# Altium project Holberton.PrjPcb (part 3 of 4)

## Sheet Feedback.SchDoc
size 420 x 297 mm; DocumentNumber: 5; SheetNumber: 13; SheetTotal: 14; PageSetup: Record=PageOptions|CenterHorizontal=True|CenterVertical=True|PrintScale=0.96|XCorrection=1.00|YCorrection=1.00|PrintKind=1|BorderSize=5000000|LeftOffset=0|BottomOffset=0|Orientation=2|PaperLength=4318|PaperWidth=2794|Scale=100|PaperSource=7|PrintQuality=600|MediaType=1|DitherType=10|PaperKind=11" x 17"|PrintScaleMode=1
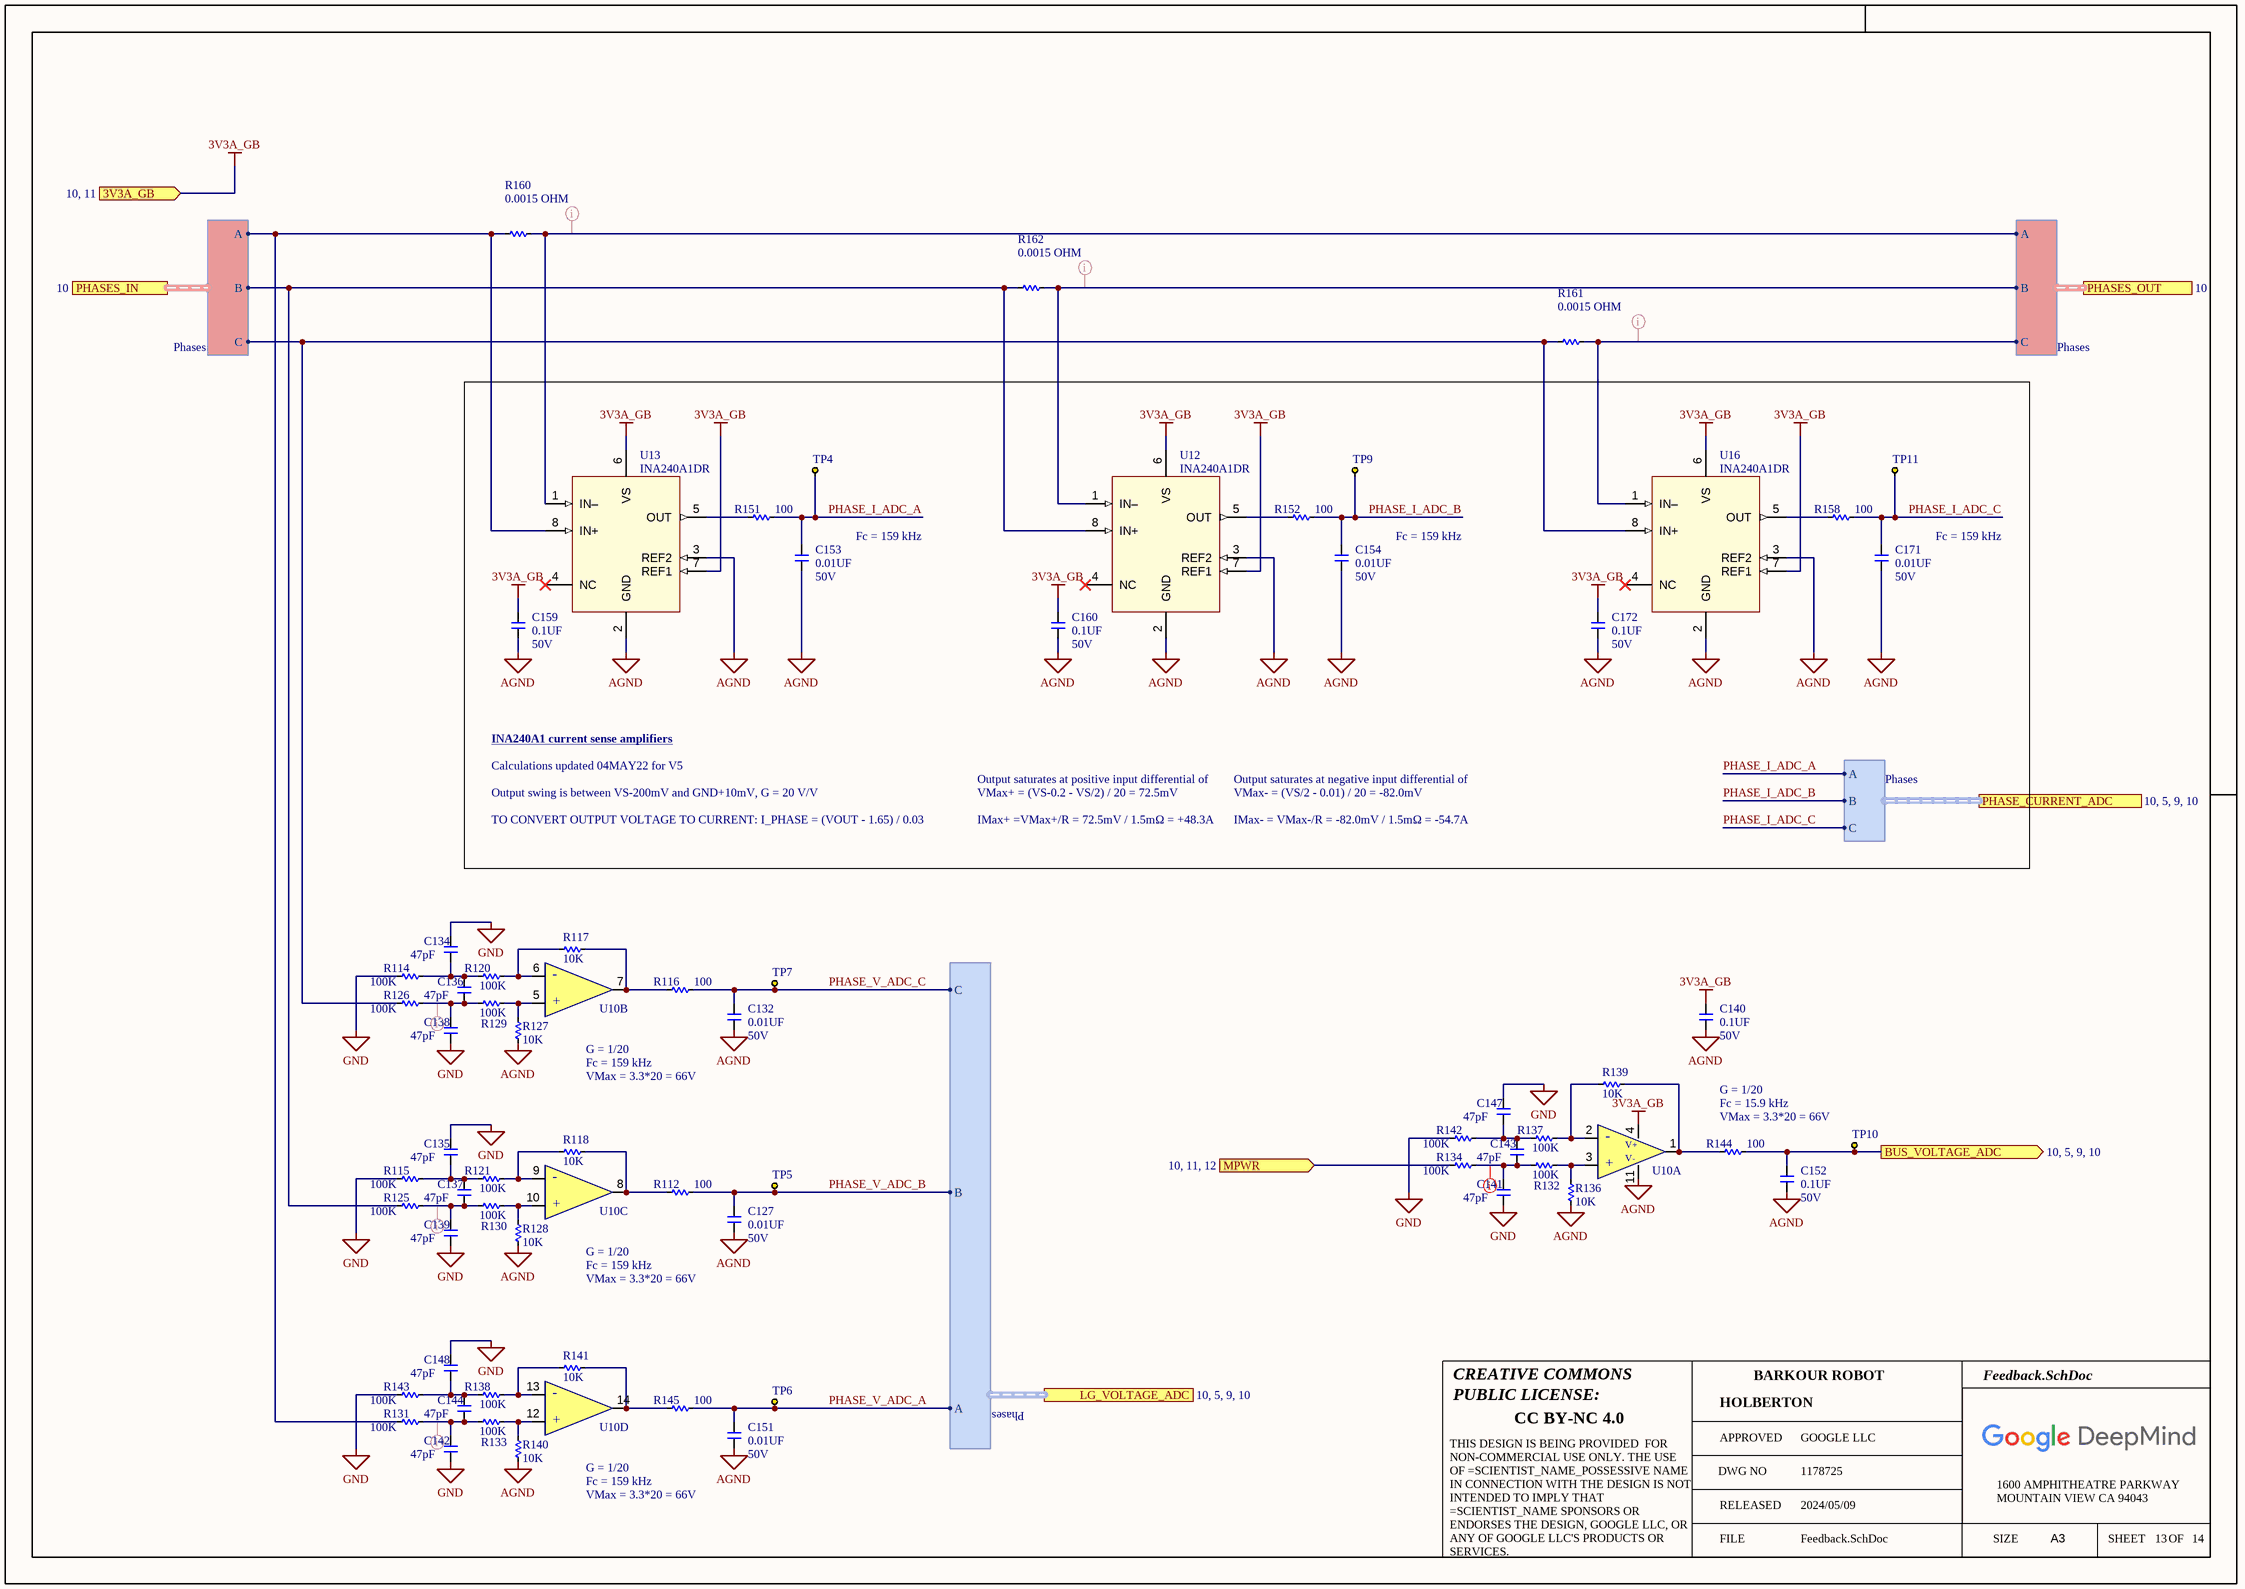
[diagram p9: Feedback.SchDoc]

### Parts
C127  value 0.01UF  Voltage: 50V  [C0402]  (hidden comment: __Template_Cap)
C132  value 0.01UF  Voltage: 50V  [C0402]  (hidden comment: __Template_Cap)
C134  value 47pF  [C0402]  (hidden comment: __Template_Cap)
C135  value 47pF  [C0402]  (hidden comment: __Template_Cap)
C136  value 47pF  [C0402]  (hidden comment: __Template_Cap)
C137  value 47pF  [C0402]  (hidden comment: __Template_Cap)
C138  value 47pF  [C0402]  (hidden comment: __Template_Cap)
C139  value 47pF  [C0402]  (hidden comment: __Template_Cap)
C140  value 0.1UF  Voltage: 50V  [C0402]  (hidden comment: __Template_Cap)
C141  value 47pF  [C0402]  (hidden comment: __Template_Cap)
C142  value 47pF  [C0402]  (hidden comment: __Template_Cap)
C143  value 47pF  [C0402]  (hidden comment: __Template_Cap)
C144  value 47pF  [C0402]  (hidden comment: __Template_Cap)
C147  value 47pF  [C0402]  (hidden comment: __Template_Cap)
C148  value 47pF  [C0402]  (hidden comment: __Template_Cap)
C151  value 0.01UF  Voltage: 50V  [C0402]  (hidden comment: __Template_Cap)
C152  value 0.1UF  Voltage: 50V  [C0402]  (hidden comment: __Template_Cap)
C153  value 0.01UF  Voltage: 50V  [C0402]  (hidden comment: __Template_Cap)
C154  value 0.01UF  Voltage: 50V  [C0402]  (hidden comment: __Template_Cap)
C159  value 0.1UF  Voltage: 50V  [C0402]  (hidden comment: __Template_Cap)
C160  value 0.1UF  Voltage: 50V  [C0402]  (hidden comment: __Template_Cap)
C171  value 0.01UF  Voltage: 50V  [C0402]  (hidden comment: __Template_Cap)
C172  value 0.1UF  Voltage: 50V  [C0402]  (hidden comment: __Template_Cap)
R112  100  [R0402]
R114  100K  [R0603]
R115  100K  [R0603]
R116  100  [R0402]
R117  10K  [R0402]
R118  10K  [R0402]
R120  100K  [R0603]
R121  100K  [R0603]
R125  100K  [R0603]
R126  100K  [R0603]
R127  10K  [R0402]
R128  10K  [R0402]
R129  100K  [R0603]
R130  100K  [R0603]
R131  100K  [R0603]
R132  100K  [R0603]
R133  100K  [R0603]
R134  100K  [R0603]
R136  10K  [R0402]
R137  100K  [R0603]
R138  100K  [R0603]
R139  10K  [R0402]
R140  10K  [R0402]
R141  10K  [R0402]
R142  100K  [R0603]
R143  100K  [R0603]
R144  100  [R0402]
R145  100  [R0402]
R151  100  [R0402]
R152  100  [R0402]
R158  100  [R0402]
R160  0.0015 OHM  [R2512]
R161  0.0015 OHM  [R2512]
R162  0.0015 OHM  [R2512]
TP4  TEST_KEYSTONE5015  [TP_KEYSTONE_5015]  (value not drawn)
TP5  TEST_KEYSTONE5015  [TP_KEYSTONE_5015]  (value not drawn)
TP6  TEST_KEYSTONE5015  [TP_KEYSTONE_5015]  (value not drawn)
TP7  TEST_KEYSTONE5015  [TP_KEYSTONE_5015]  (value not drawn)
TP9  TEST_KEYSTONE5015  [TP_KEYSTONE_5015]  (value not drawn)
TP10  TEST_KEYSTONE5015  [TP_KEYSTONE_5015]  (value not drawn)
TP11  TEST_KEYSTONE5015  [TP_KEYSTONE_5015]  (value not drawn)
U10  MCP6064  [14TSSOP65]  (value not drawn)  (parts A,B,C,D of 4)
U12  INA240A1DR  [TI SOIC-8 D0008A]
U13  INA240A1DR  [TI SOIC-8 D0008A]
U16  INA240A1DR  [TI SOIC-8 D0008A]

### Ports
3V3A_GB (in, see 10, 11), BUS_VOLTAGE_ADC (out, see 10, 5, 9, 10), LG_VOLTAGE_ADC (harness Phases, see 10, 5, 9, 10), MPWR (in, see 10, 11, 12), PHASE_CURRENT_ADC (harness Phases, see 10, 5, 9, 10), PHASES_IN (harness Phases, see 10), PHASES_OUT (harness Phases, see 10)

### Harnesses
Phases: A, B, C

### Nets
3V3A_GB: C140.1 C159.1 C160.1 C172.1 U10.4 U12.6(VS) U12.7(REF1) U13.6(VS) U13.7(REF1) U16.6(VS) U16.7(REF1) ; port 3V3A_GB
AGND: C127.2 C132.2 C140.2 C151.2 C152.2 C153.2 C154.2 C159.2 C160.2 C171.2 C172.2 R127.1 R128.1 R136.1 R140.1 U10.11 U12.2(GND) U12.3(REF2) U13.2(GND) U13.3(REF2) U16.2(GND) U16.3(REF2)
GND: C134.2 C135.2 C138.1 C139.1 C141.1 C142.1 C147.2 C148.2 R114.1 R115.1 R142.1 R143.1
MPWR: R134.1 ; port MPWR
BUS_VOLTAGE_ADC: C152.1 R144.2 TP10.1 ; port BUS_VOLTAGE_ADC
PHASE_I_ADC_A: C153.1 R151.2 TP4.1 ; port PHASE_CURRENT_ADC.A  [project net IA_ADC]
PHASE_I_ADC_B: C154.1 R152.2 TP9.1 ; port PHASE_CURRENT_ADC.B  [project net IB_ADC]
PHASE_I_ADC_C: C171.1 R158.2 TP11.1 ; port PHASE_CURRENT_ADC.C  [project net IC_ADC]
PHASE_V_ADC_A: C151.1 R145.2 TP6.1 ; port LG_VOLTAGE_ADC.A
PHASE_V_ADC_B: C127.1 R112.2 TP5.1 ; port LG_VOLTAGE_ADC.B
PHASE_V_ADC_C: C132.1 R116.2 TP7.1 ; port LG_VOLTAGE_ADC.C
PHASEA: R131.1 R160.1 U13.8(IN+) ; port PHASES_IN.A
PHASEA_OUT: R160.2 U13.1(IN–) ; port PHASES_OUT.A
PHASEB: R125.1 R162.1 U12.8(IN+) ; port PHASES_IN.B
PHASEB_OUT: R162.2 U12.1(IN–) ; port PHASES_OUT.B
PHASEC: R126.1 R161.1 U16.8(IN+) ; port PHASES_IN.C
PHASEC_OUT: R161.2 U16.1(IN–) ; port PHASES_OUT.C
NetC134_1: C134.1 C136.2 R114.2 R120.1
NetC135_1: C135.1 C137.2 R115.2 R121.1
NetC136_1: C136.1 C138.2 R126.2 R129.1
NetC137_1: C137.1 C139.2 R125.2 R130.1
NetC141_2: C141.2 C143.1 R132.1 R134.2
NetC142_2: C142.2 C144.1 R131.2 R133.1
NetC143_2: C143.2 C147.1 R137.1 R142.2
NetC144_2: C144.2 C148.1 R138.1 R143.2
NetR112_1: R112.1 R118.1 U10.8
NetR116_1: R116.1 R117.1 U10.7
NetR117_2: R117.2 R120.2 U10.6
NetR118_2: R118.2 R121.2 U10.9
NetR127_2: R127.2 R129.2 U10.5
NetR128_2: R128.2 R130.2 U10.10
NetR132_2: R132.2 R136.2 U10.3
NetR133_2: R133.2 R140.2 U10.12
NetR137_2: R137.2 R139.2 U10.2
NetR138_2: R138.2 R141.2 U10.13
NetR139_1: R139.1 R144.1 U10.1
NetR141_1: R141.1 R145.1 U10.14
NetR151_1: R151.1 U13.5(OUT)
NetR152_1: R152.1 U12.5(OUT)
NetR158_1: R158.1 U16.5(OUT)

Not connected (* = marked no-connect by the designer): U12 4(NC)*; U13 4(NC)*; U16 4(NC)*

### Layout directives
net class HVSW: NetC136_1, NetC137_1, NetC142_2, PHASEA_OUT, PHASEB_OUT, PHASEC_OUT
net class HV: NetC141_2

### Notes on the sheet
- Fc = 159 kHz
- Output swing is between VS-200mV and GND+10mV, G = 20 V/V
- INA240A1 current sense amplifiers <https://www.ti.com/lit/ds/symlink/ina240.pdf>
- Calculations updated 04MAY22 for V5
- VMax+ = (VS-0.2 - VS/2) / 20 = 72.5mV
- Output saturates at positive input differential of
- VMax- = (VS/2 - 0.01) / 20 = -82.0mV
- Output saturates at negative input differential of
- TO CONVERT OUTPUT VOLTAGE TO CURRENT: I_PHASE = (VOUT - 1.65) / 0.03
- IMax+ =VMax+/R = 72.5mV / 1.5mΩ = +48.3A
- IMax- = VMax-/R = -82.0mV / 1.5mΩ = -54.7A
- (near U10) G = 1/20
- VMax = 3.3*20 = 66V
- Fc = 15.9 kHz
- G = 1/20
- CREATIVE COMMONS
- PUBLIC LICENSE:
- BARKOUR ROBOT
- CC BY-NC 4.0
- APPROVED
- DWG NO
- GOOGLE LLC
- FILE
- RELEASED
- 2024/05/09
- SIZE
- 1600 AMPHITHEATRE PARKWAY
- MOUNTAIN VIEW CA 94043
- A3
- SHEET
- OF
- THIS DESIGN IS BEING PROVIDED  FOR NON-COMMERCIAL USE ONLY. THE USE OF =SCIENTIST_NAME_POSSESSIVE NAME IN CONNECTION WITH THE DESIGN IS NOT INTENDED TO IMPLY THAT =SCIENTIST_NAME SPONSORS OR ENDORSES THE DESIGN, GOOGLE LLC, OR ANY OF GOOGLE LLC'S PRODUCTS OR SERVICES.
- (in symbol MICROCHIP_MCP6064, part A) -; V+; V-; +
- (in symbol MICROCHIP_MCP6064, part B) -; +
- (in symbol MICROCHIP_MCP6064, part C) -; +
- (in symbol MICROCHIP_MCP6064, part D) -; +

### Library data of the parts
C127 C132 C151 C153 C154 C171 = 625: CAP, CER, X7R, 0.01uF, 50V, 20%, 0402, 0.56mm T; MFG: KEMET; MFG P/N: C0402C103M5RACTU; COMMON: 150-00227-00; Status: Released; Package: 0402; Supplier 1: Digi-Key; ComponentLink1URL: https://www.digikey.com/en/products/detail/kemet/C0402C103M5RAC7867/2196227; Supplier Part Number 1: 399-C0402C103M5RAC7867CT-ND
C134-C139 C141-C144 C147 C148 = 1447: CAP, CER, C0G, 47PF, 5%, 50V, 0402; MFG: TDK; MFG P/N: C1005C0G1H470J050BA; COMMON: 150-00181-00; Status: NRND; Package: 0402; Voltage: 50V; Supplier 1: Digi-Key; ComponentLink1URL: https://www.digikey.com/en/products/detail/tdk-corporation/C1005C0G1H470J050BA/513693; Supplier Part Number 1: 445-1243-1-ND
C140 C152 C159 C160 C172 = 1762: CAP, CER, X5R, 0.1uF, 10%, 50V, 0402, 0.55mm; MFG: YAGEO; MFG P/N: CC0402KRX5R9BB104; Status: Released; Package: 0402; Supplier 1: Digi-Key; ComponentLink1URL: http://www.yageo.com/documents/recent/UPY-GPHC_X5R_4V-to-50V_25.pdf; Supplier Part Number 1: 311-3342-1-ND
R112 R116 R144 R145 R151 R152 R158 = 7286: RES, 100, 1%, 1/10W, 0402, AUTO GRADE; MFG: PANASONIC; MFG P/N: ERJ2RKF1000X; COMMON: 470-00294-00; Status: Released; Package: 0402; Value: 100; Supplier 1: Digi-Key; ComponentLink1URL: https://www.digikey.com/en/products/detail/panasonic-electronic-components/ERJ-2RKF1000X/192080; Supplier Part Number 1: P100LCT-ND
R114 R115 R120 R121 R125 R126 R129-R134 R137 R138 R142 R143 = 6516: RES, 100K, 1%, 1/10W, 0603, AUTO GRADE; MFG: PANASONIC; MFG P/N: ERJ3EKF1003V; COMMON: 470-00120-00; Status: Released; Package: 0603; Value: 100K; Supplier 1: Digi-Key; ComponentLink1URL: https://www.digikey.com/en/products/detail/panasonic-electronic-components/ERJ-3EKF1003V/196075; Supplier Part Number 1: P100KHCT-ND
R117 R118 R127 R128 R136 R139-R141 = 7216: RES, 10K, 1%, 1/10W, 0402, AUTOGRADE; MFG: PANASONIC; MFG P/N: ERJ2RKF1002X; COMMON: 470-00319-00; Status: Released; Package: 0402; Value: 10K; Supplier 1: Digi-Key; ComponentLink1URL: https://www.digikey.com/en/products/detail/panasonic-electronic-components/ERJ-2RKF1002X/192073; Supplier Part Number 1: P10.0KLCT-ND
R160-R162 = 9999: RES, 0.0015, 1%, 3W, 2512; MFG: TE Connectivity Passive Product; MFG P/N: TLR3A30DR0015FTDG; Status: Released; Package: 2512; Value: 0.0015 OHM; Supplier 1: Digi-Key; ComponentLink1URL: https://www.te.com/commerce/DocumentDelivery/DDEController?Action=srchrtrv&DocNm=1773449-3&DocType=DS&DocLang=English; Supplier Part Number 1: A131795CT-ND
TP4-TP7 TP9-TP11 = TEST_KEYSTONE5015: PC TEST POINT MINIATURE SMT; MFG: Keystone Electronics; MFG P/N: 5015; Value: 5015; COMMON: 250-00207-00; Supplier 1: Digi-Key; ComponentLink1URL: http://mail.keyelco.com/ENG._DEPT/PDF%20CAT%20NO%20Drawings/5015.pdf; Supplier Part Number 1: 36-5015CT-ND; Status: In Development
U10 = MICROCHIP_MCP6064: Microchip MCP6064-E/ST; Quad Op Amp; 0.73MHz CMOS; Rail to Rail; 3V; 5V; 14-Pin TSSOP; MFG: Microchip Technology; ComponentLink1URL: http://www.microchip.com/mymicrochip/filehandler.aspx?ddocname=en528763; Supplier 1: Digi-Key; Supplier Part Number 1: MCP6064-E/ST-ND; MFG P/N: MCP6064-E/ST; Value: MCP6064-E/ST
U12 U13 U16 = INA240A1: Current Sense Amplifiers -4 to 80V, bidirectional, ultra-precise current sense amplifier with enhanced PWM rejection, 20V/V gain; MFG: Texas Instruments; Supplier 1: Digi-Key; Supplier Part Number 1: 296-51172-1-ND; ComponentLink1URL: https://www.digikey.com/en/products/detail/texas-instruments/INA240A1DR/8538109; MFG P/N: INA240A1DR; Value: INA240A1DR

## Sheet Drive.SchDoc
size 420 x 297 mm; DocumentNumber: 2; SheetNumber: 11; SheetTotal: 14; PageSetup: Record=PageOptions|CenterHorizontal=True|CenterVertical=True|PrintScale=0.96|XCorrection=1.00|YCorrection=1.00|PrintKind=1|BorderSize=5000000|LeftOffset=0|BottomOffset=0|Orientation=2|PaperLength=4318|PaperWidth=2794|Scale=100|PaperSource=7|PrintQuality=600|MediaType=1|DitherType=10|PaperKind=11" x 17"|PrintScaleMode=1
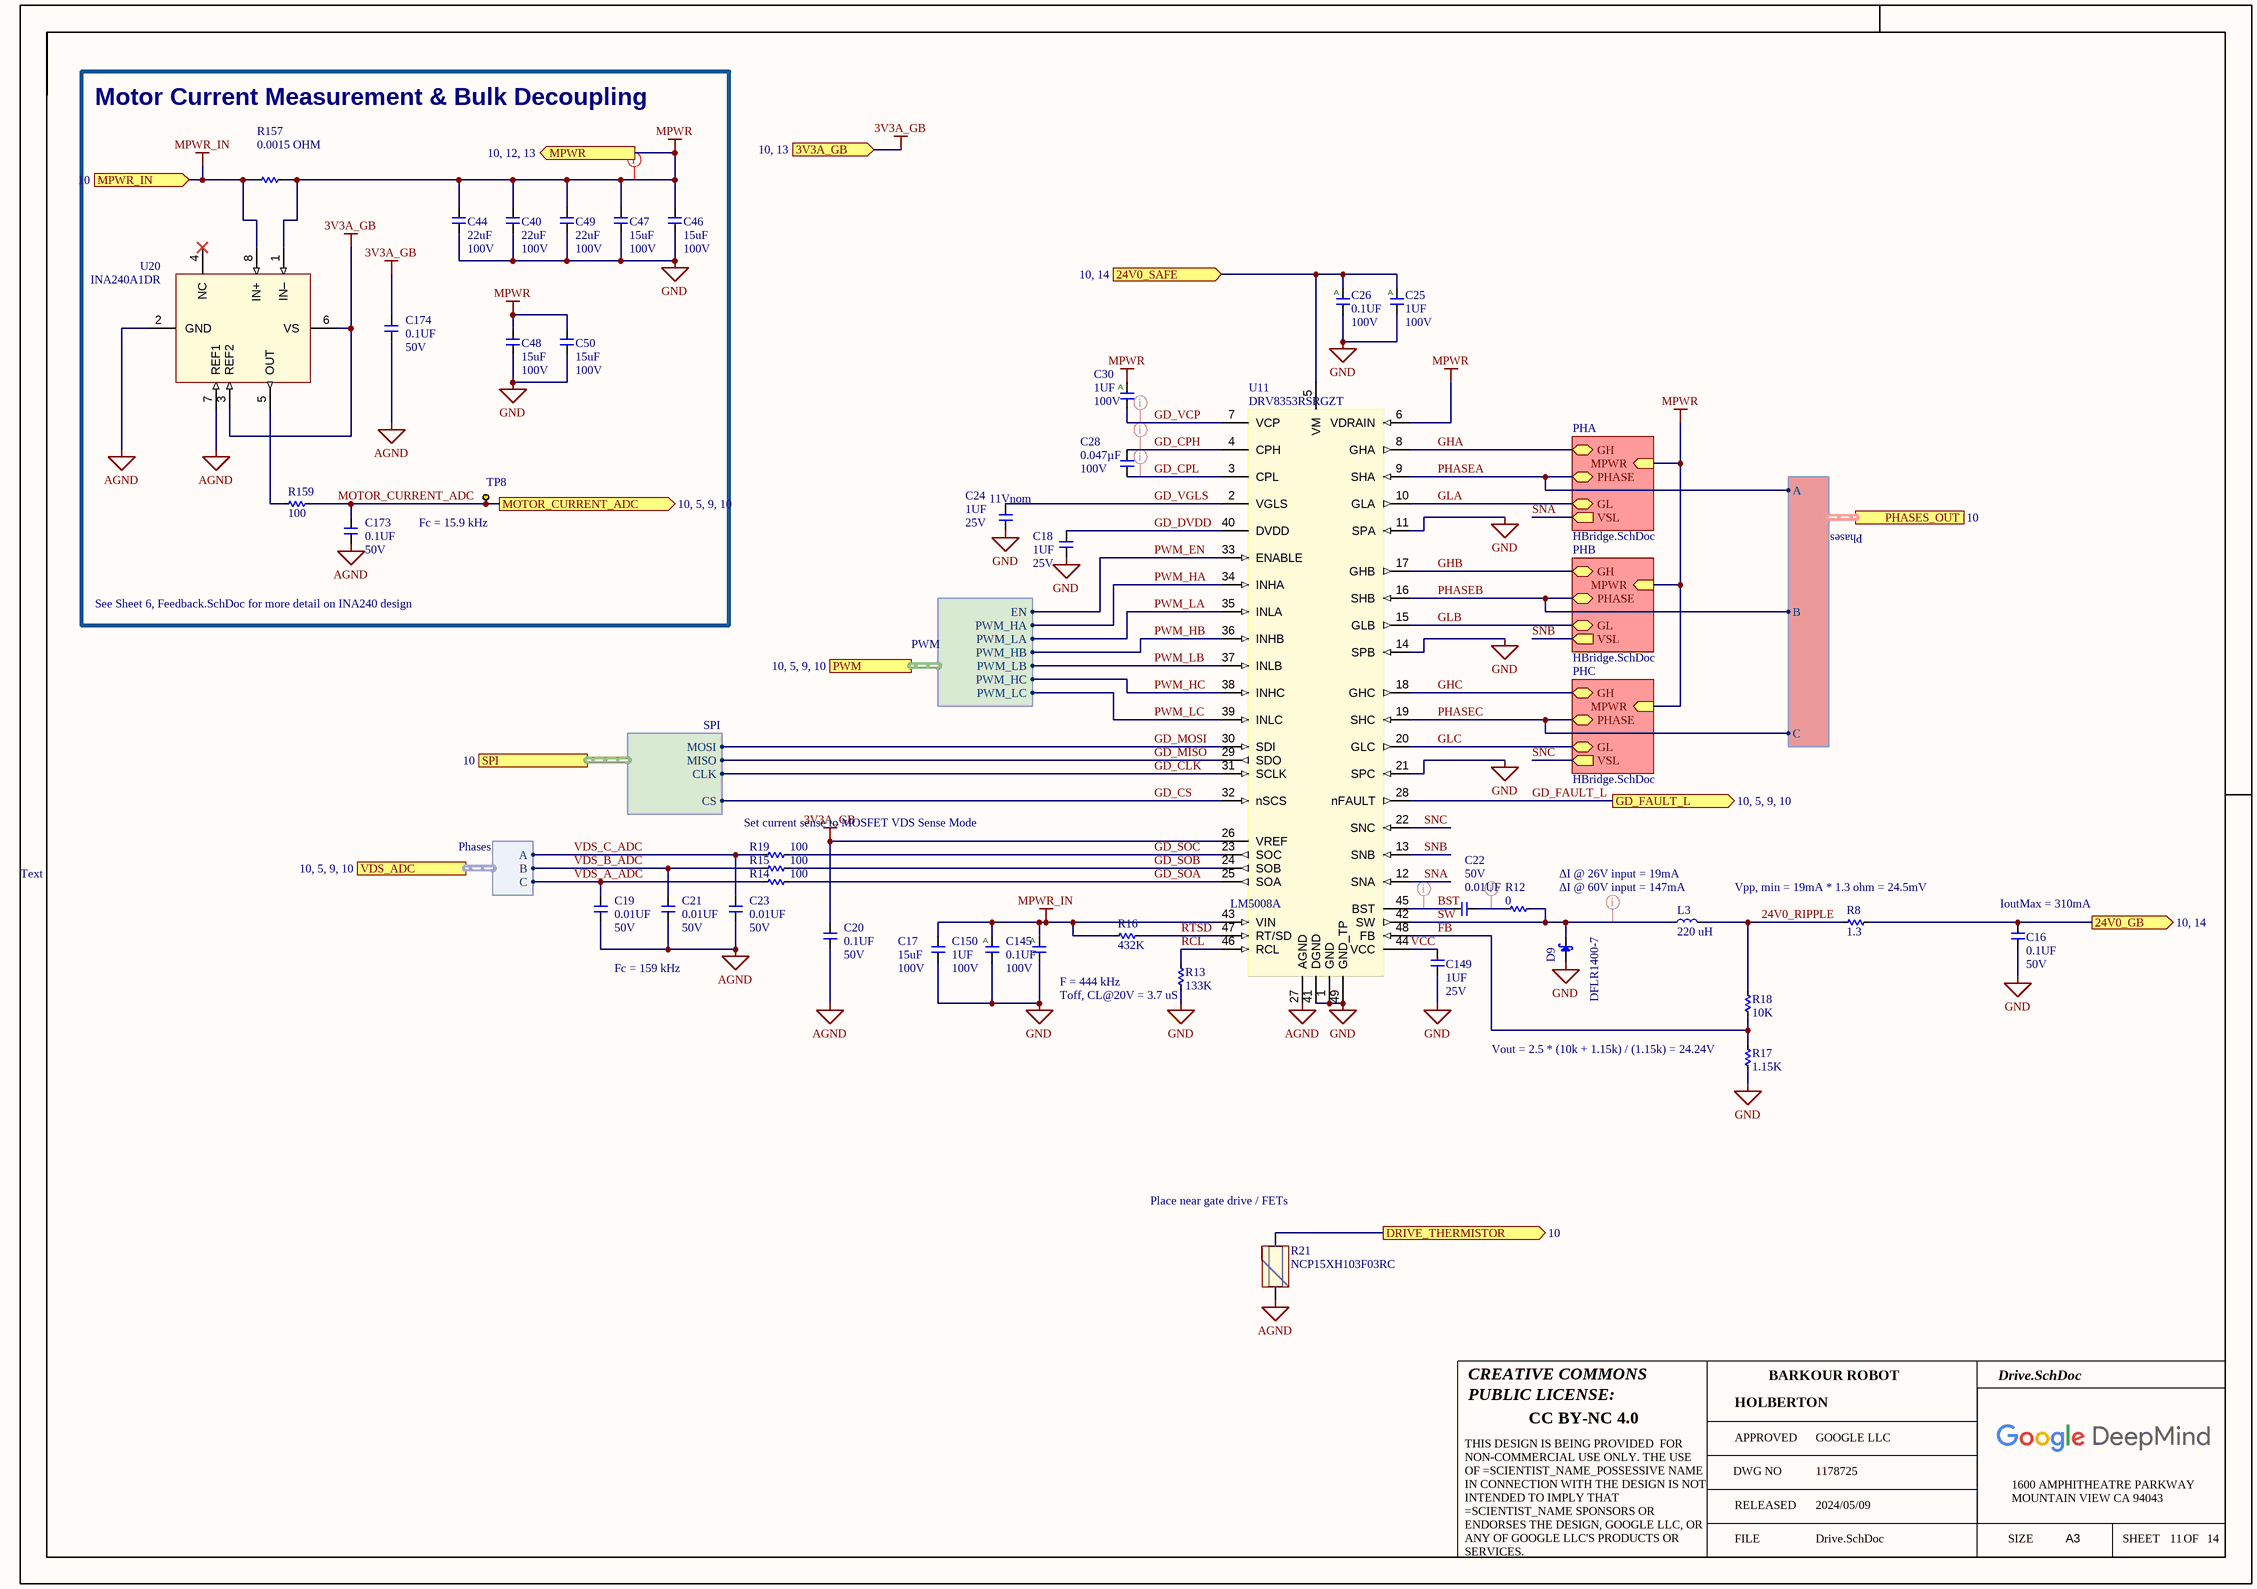
[diagram p10: Drive.SchDoc]

### Parts
C16  value 0.1UF  Voltage: 50V  [C0402]  (hidden comment: __Template_Cap)
C17  value 15uF  Voltage: 100V  [C2220]  (hidden comment: __Template_Cap)
C18  value 1UF  Voltage: 25V  [C0402]  (hidden comment: __Template_Cap)
C19  value 0.01UF  Voltage: 50V  [C0402]  (hidden comment: __Template_Cap)
C20  value 0.1UF  Voltage: 50V  [C0402]  (hidden comment: __Template_Cap)
C21  value 0.01UF  Voltage: 50V  [C0402]  (hidden comment: __Template_Cap)
C22  value 0.01UF  Voltage: 50V  [C0402]  (hidden comment: __Template_Cap)
C23  value 0.01UF  Voltage: 50V  [C0402]  (hidden comment: __Template_Cap)
C24  value 1UF  Voltage: 25V  [C0402]  (hidden comment: __Template_Cap)
C25  value 1UF  Voltage: 100V  [C0805]  (hidden comment: __Template_Cap_Auto)
C26  value 0.1UF  Voltage: 100V  [C0603]  (hidden comment: __Template_Cap_Auto)
C28  value 0.047µF  Voltage: 100V  [C0603]  (hidden comment: __Template_Cap)
C30  value 1UF  Voltage: 100V  [C0805]  (hidden comment: __Template_Cap_Auto)
C40  value 22uF  Voltage: 100V  [CAP_CKG57NX7S2A226M500JJ]  (hidden comment: __Template_Cap)
C44  value 22uF  Voltage: 100V  [CAP_CKG57NX7S2A226M500JJ]  (hidden comment: __Template_Cap)
C46  value 15uF  Voltage: 100V  [C2220]  (hidden comment: __Template_Cap)
C47  value 15uF  Voltage: 100V  [C2220]  (hidden comment: __Template_Cap)
C48  value 15uF  Voltage: 100V  [C2220]  (hidden comment: __Template_Cap)
C49  value 22uF  Voltage: 100V  [CAP_CKG57NX7S2A226M500JJ]  (hidden comment: __Template_Cap)
C50  value 15uF  Voltage: 100V  [C2220]  (hidden comment: __Template_Cap)
C145  value 0.1UF  Voltage: 100V  [C0603]  (hidden comment: __Template_Cap_Auto)
C149  value 1UF  Voltage: 25V  [C0402]  (hidden comment: __Template_Cap)
C150  value 1UF  Voltage: 100V  [C0805]  (hidden comment: __Template_Cap_Auto)
C173  value 0.1UF  Voltage: 50V  [C0402]  (hidden comment: __Template_Cap)
C174  value 0.1UF  Voltage: 50V  [C0402]  (hidden comment: __Template_Cap)
D9  value DFLR1400-7  [POWERDI123_DFLS1100-7]  (hidden comment: __Template_Diode_Schottky_A/K)
L3  value 220 uH  [IND_74404054221]  (hidden comment: __Template_Inductor)
R8  1.3  [R0805]
R12  0  [R0402]
R13  133K  [R0402]
R14  100  [R0402]
R15  100  [R0402]
R16  432K  [R0402]
R17  1.15K  [R0402]
R18  10K  [R0402]
R19  100  [R0402]
R21  Mfg P/N: NCP15XH103F03RC  [R0402]  (hidden comment: __Template_Thermistor)
R157  0.0015 OHM  [R2512]
R159  100  [R0402]
TP8  TEST_KEYSTONE5015  [TP_KEYSTONE_5015]  (value not drawn)
U11  MFG P/N: DRV8353RSRGZT  [VQFN50P700X700X100-48-TP_TP-CUST_NO_VIAS]  (hidden comment: MOTOR_DRIVE_DRV8353RSRGZT)
U20  INA240A1DR  [TI SOIC-8 D0008A]

### Blocks framed on the sheet
Motor Current Measurement & Bulk Decoupling: C40 C44 C46-C50 C173 C174 R157 R159 TP8 U20

### Sub-sheets
PHA = HBridge.SchDoc: GL (bidir), GH (bidir), PHASE (bidir), MPWR (in), VSL (out)
PHB = HBridge.SchDoc: GL (bidir), GH (bidir), PHASE (bidir), MPWR (in), VSL (out)
PHC = HBridge.SchDoc: GL (bidir), GH (bidir), PHASE (bidir), MPWR (in), VSL (out)

### Ports
3V3A_GB (in, see 10, 13), 24V0_GB (out, see 10, 14), 24V0_SAFE (in, see 10, 14), DRIVE_THERMISTOR (out, see 10), GD_FAULT_L (out, see 10, 5, 9, 10), MOTOR_CURRENT_ADC (out, see 10, 5, 9, 10), MPWR (out, see 10, 12, 13), MPWR_IN (in, see 10), PHASES_OUT (harness Phases, see 10), PWM (harness PWM, see 10, 5, 9, 10), SPI (harness SPI, see 10), VDS_ADC (harness Phases, see 10, 5, 9, 10)

### Harnesses
Phases: A, B, C
SPI: CLK, CS, MOSI, MISO
PWM: EN, PWM_HA, PWM_LA, PWM_HB, PWM_LB, PWM_HC, PWM_LC

### Nets
3V3A_GB: C20.1 C174.1 U11.26(VREF) U20.3(REF2) U20.6(VS) ; port 3V3A_GB
24V0_GB: C16.1 R8.2 ; port 24V0_GB
AGND: C19.2 C20.2 C21.2 C23.2 C173.2 C174.2 R21.2 U11.27(AGND) U20.2(GND) U20.7(REF1)
GND: C16.2 C17.2 C18.2 C24.2 C25.2 C26.2 C40.2 C44.2 C46.2 C47.2 C48.2 C49.2 C50.2 C145.2 C149.2 C150.2 D9.A R13.1 R17.1 U11.1(GND) U11.11(SPA) U11.14(SPB) U11.21(SPC) U11.41(DGND) U11.49(GND_TP)
MPWR: C30.1 C40.1 C44.1 C46.1 C47.1 C48.1 C49.1 C50.1 R157.2 U11.6(VDRAIN) U20.1(IN–) ; port MPWR, sheet PHA/MPWR, sheet PHB/MPWR, sheet PHC/MPWR
MPWR_IN: C17.1 C145.1 C150.1 R16.1 R157.1 U11.43(VIN) U20.8(IN+) ; port MPWR_IN
24V0_RIPPLE: L3.2 R8.1 R18.2
24V0_SAFE: C25.1 C26.1 U11.5(VM) ; port 24V0_SAFE
BST: C22.1 U11.45(BST)
DRIVE_THERM: R21.1 ; port DRIVE_THERMISTOR
FB: R17.2 R18.1 U11.48(FB)
GD_CLK: U11.31(SCLK) ; port SPI.CLK
GD_CPH: C28.1 U11.4(CPH)
GD_CPL: C28.2 U11.3(CPL)
GD_CS: U11.32(nSCS) ; port SPI.CS
GD_DVDD: C18.1 U11.40(DVDD)
GD_FAULT_L: U11.28(nFAULT) ; port GD_FAULT_L
GD_MISO: U11.29(SDO) ; port SPI.MISO
GD_MOSI: U11.30(SDI) ; port SPI.MOSI
GD_SOA: R14.2 U11.25(SOA)
GD_SOB: R15.2 U11.24(SOB)
GD_SOC: R19.2 U11.23(SOC)
GD_VCP: C30.2 U11.7(VCP)
GD_VGLS: C24.1 U11.2(VGLS)
GHA: U11.8(GHA) ; sheet PHA/GH
GHB: U11.17(GHB) ; sheet PHB/GH
GHC: U11.18(GHC) ; sheet PHC/GH
GLA: U11.10(GLA) ; sheet PHA/GL
GLB: U11.15(GLB) ; sheet PHB/GL
GLC: U11.20(GLC) ; sheet PHC/GL
MOTOR_CURRENT_ADC: C173.1 R159.2 TP8.1 ; port MOTOR_CURRENT_ADC
PHASEA: U11.9(SHA) ; sheet PHA/PHASE, port PHASES_OUT.A
PHASEB: U11.16(SHB) ; sheet PHB/PHASE, port PHASES_OUT.B
PHASEC: U11.19(SHC) ; sheet PHC/PHASE, port PHASES_OUT.C
PWM_EN: U11.33(ENABLE) ; port PWM.EN  [project net GD_PWM_EN]
PWM_HA: U11.34(INHA) ; port PWM.PWM_HA  [project net GD_PWM_HA]
PWM_HB: U11.36(INHB) ; port PWM.PWM_HB  [project net GD_PWM_HB]
PWM_HC: U11.38(INHC) ; port PWM.PWM_HC  [project net GD_PWM_HC]
PWM_LA: U11.35(INLA) ; port PWM.PWM_LA  [project net GD_PWM_LA]
PWM_LB: U11.37(INLB) ; port PWM.PWM_LB  [project net GD_PWM_LB]
PWM_LC: U11.39(INLC) ; port PWM.PWM_LC  [project net GD_PWM_LC]
RCL: R13.2 U11.46(RCL)
RTSD: R16.2 U11.47(RT/SD)
SNA: U11.12(SNA) ; sheet PHA/VSL
SNB: U11.13(SNB) ; sheet PHB/VSL
SNC: U11.22(SNC) ; sheet PHC/VSL
SW: D9.K L3.1 R12.2 U11.42(SW)
VCC: C149.1 U11.44(VCC)
VDS_A_ADC: C19.1 R14.1 ; port VDS_ADC.C
VDS_B_ADC: C21.1 R15.1 ; port VDS_ADC.B
VDS_C_ADC: C23.1 R19.1 ; port VDS_ADC.A
NetC22_2: C22.2 R12.1
NetR159_1: R159.1 U20.5(OUT)

Not connected (* = marked no-connect by the designer): U20 4(NC)*

### Layout directives
net class HVSW: BST, GD_CPH, GD_CPL, GD_VCP, NetC22_2, SW
net class HV: MPWR

### Notes on the sheet
- (near TP8) Fc = 15.9 kHz
- 11Vnom
- See Sheet 6, Feedback.SchDoc for more detail on INA240 design
- (near U11) Set current sense to MOSFET VDS Sense Mode
- Text
- (near U11) LM5008A
- ΔI @ 26V input = 19mA
- ΔI @ 60V input = 147mA
- (near R8) Vpp, min = 19mA * 1.3 ohm = 24.5mV
- IoutMax = 310mA
- Fc = 159 kHz
- F = 444 kHz
- (near R13) Toff, CL@20V = 3.7 uS
- (near R17) Vout = 2.5 * (10k + 1.15k) / (1.15k) = 24.24V
- (near R21) Place near gate drive / FETs
- CREATIVE COMMONS
- PUBLIC LICENSE:
- BARKOUR ROBOT
- CC BY-NC 4.0
- APPROVED
- DWG NO
- GOOGLE LLC
- FILE
- RELEASED
- 2024/05/09
- SIZE
- 1600 AMPHITHEATRE PARKWAY
- MOUNTAIN VIEW CA 94043
- A3
- SHEET
- OF
- THIS DESIGN IS BEING PROVIDED  FOR NON-COMMERCIAL USE ONLY. THE USE OF =SCIENTIST_NAME_POSSESSIVE NAME IN CONNECTION WITH THE DESIGN IS NOT INTENDED TO IMPLY THAT =SCIENTIST_NAME SPONSORS OR ENDORSES THE DESIGN, GOOGLE LLC, OR ANY OF GOOGLE LLC'S PRODUCTS OR SERVICES.
- (in symbol 1039) A
- (in symbol 1093) A

### Library data of the parts
C16 C20 C173 C174 = 1762: as C140 on sheet Feedback; Status: Released; Package: 0402; Supplier 1: Digi-Key; ComponentLink1URL: http://www.yageo.com/documents/recent/UPY-GPHC_X5R_4V-to-50V_25.pdf; Supplier Part Number 1: 311-3342-1-ND
C17 C46-C48 C50 = 207: CAP, CER, X7S, 15uF, 100V, 20%, 2220, 2.8mm T; MFG: TDK; MFG P/N: CKG57KX7S2A156M335JH; Status: Released; Package: 2220; Supplier 1: Mouser; ComponentLink1URL: https://www.mouser.com/ProductDetail/TDK/CKG57KX7S2A156M335JH?qs=xLDY6iXSiQZjzyWjP57ZVA%3D%3D; Supplier Part Number 1: 810-CKG57KX7S2A156MH
C18 C24 C149 = 1717: CAP, CER, X5R, 1uF, 10%, 25V, 0402; MFG: TDK; MFG P/N: C1005X5R1E105K050BC; COMMON: 150-01202-00; Status: Released; Package: 0402; Supplier 1: Digi-Key; ComponentLink1URL: https://product.tdk.com/info/en/catalog/datasheets/mlcc_commercial_general_en.pdf; Supplier Part Number 1: 445-9066-1-ND
C19 C21-C23 = 625: as C127 on sheet Feedback; Status: Released; Package: 0402; Supplier 1: Digi-Key; ComponentLink1URL: https://www.digikey.com/en/products/detail/kemet/C0402C103M5RAC7867/2196227; Supplier Part Number 1: 399-C0402C103M5RAC7867CT-ND
C25 C30 C150 = 1093: CAP, CER, X7S, 1uF, 20%, 100V, 0805; MFG: TDK; MFG P/N: CGA4J3X7S2A105M125AE; COMMON: 150-01093-00; Status: Released; Package: 0805; Supplier 1: Digi-Key; ComponentLink1URL: https://www.digikey.com/en/products/detail/tdk-corporation/CGA4J3X7S2A105M125AE/2782484; Supplier Part Number 1: 445-7961-1-ND
C26 C145 = 1039: CAP, CER, X7S, 0.1uF, 100V, 10%, 0603, AUTOGRADE; MFG: TDK; MFG P/N: CGA3E3X7S2A104K080AB; COMMON: 150-00222-00; Status: Released; Package: 0603; Supplier 1: Digi-Key; ComponentLink1URL: https://www.digikey.com/en/products/detail/tdk-corporation/CGA3E3X7S2A104K080AB/2672831; Supplier Part Number 1: 445-6938-1-ND
C28 = 1838: CAP, CER, X7R, 0.047uF, 100V, 10%, 0603, AUTOGRADE; MFG: Samsung Electro-Mechanics; MFG P/N: CL10B473KC8WPNC; Status: Released; Package: 0603; Supplier 1: Mouser; ComponentLink1URL: https://www.mouser.com/ProductDetail/Samsung-Electro-Mechanics/CL10B473KC8WPNC?qs=xZ%2FP%252Ba9zWqZHK%252B26%2FNJNOA%3D%3D; Supplier Part Number 1: 87-CL10B473KC8WPNC
C40 C44 C49 = 207: CAP CER 22UF 100V X7S SMD (6.00mm x 5.00mm x 5.5mm); MFG: TDK; MFG P/N: CKG57NX7S2A226M500JJ; Status: Released; Supplier 1: Digi-Key; ComponentLink1URL: https://www.mouser.com/ProductDetail/TDK/CKG57KX7S2A156M335JH?qs=xLDY6iXSiQZjzyWjP57ZVA%3D%3D; Supplier Part Number 1: 445-10513-1-ND
D9 = 203: DIODE, SCHOTTKY, 100V, 1A, POWERDI123; MFG: Diodes Incorporated; Status: Released; MFG P/N: DFLR1400-7; Package: POWERDI®123; Supplier 1: Digi-Key; ComponentLink1URL: https://www.digikey.com/en/products/detail/diodes-incorporated/DFLR1400-7/776775; Supplier Part Number 1: DFLR1400DICT-ND
L3 = 938: 220 µH Semi-Shielded Drum Core, Wirewound Inductor 500 mA 1.4Ohm Nonstandard; MFG: Würth Elektronik; MFG P/N: 74404054221; Status: Released; Package: 2 - pin SMD; Supplier 1: Digi-Key; ComponentLink1URL: https://www.coilcraft.com/en-us/products/power/shielded-inductors/ferrite-drum/mss-mos/mss7348/#; Supplier Part Number 1: 732-11722-1-ND
R8 = 8516: RES, 1.3, 1%, 1/2W, AUTOGRADE, 0805; MFG: Panasonic Electronic Components; MFG P/N: ERJ-6DQF1R3V; Status: Released; Package: 0805; Value: 1.3; Supplier 1: Digi-Key; ComponentLink1URL: https://industrial.panasonic.com/cdbs/www-data/pdf/RDN0000/AOA0000C313.pdf; Supplier Part Number 1: P19271CT-ND
R12 = 8004: RES, 0, JUMPER, 1/16W, 0402; MFG: YAGEO; MFG P/N: RC0402FR-070RL; COMMON: 470-02332-00; Status: Released; Package: 0402; Value: 0; Supplier 1: Digi-Key; ComponentLink1URL: https://www.digikey.com/en/products/detail/yageo/RC0402FR-070RL/2827570; Supplier Part Number 1: 311-0.0LRCT-ND
R13 = 5074: RES, 133K, 1%, 1/16W, 0402, AUTOGRADE; MFG: VISHAY; MFG P/N: CRCW0402133KFKED; COMMON: 470-02579-00; Status: Released; Package: 0402; Value: 133K; Supplier 1: Digi-Key; ComponentLink1URL: https://www.digikey.com/en/products/detail/vishay-dale/CRCW0402133KFKED/1178248; Supplier Part Number 1: 541-133KLCT-ND
R14 R15 R19 R159 = 7286: as R112 on sheet Feedback; Status: Released; Package: 0402; Value: 100; Supplier 1: Digi-Key; ComponentLink1URL: https://www.digikey.com/en/products/detail/panasonic-electronic-components/ERJ-2RKF1000X/192080; Supplier Part Number 1: P100LCT-ND
R16 = 8801: RES, 432K, 1%, 1/16W, 0402; MFG: VISHAY; MFG P/N: CRCW0402432KFKED; Status: Released; Package: 0402; Value: 432K; Supplier 1: Digi-Key; ComponentLink1URL: http://www.vishay.com/docs/28773/crcwce3.pdf; Supplier Part Number 1: 541-432KLCT-ND
R17 = 8684: RES, 1.15K, 1%, 1/16W, 0402; MFG: VISHAY; MFG P/N: CRCW04021K15FKED; Status: Released; Package: 0402; Value: 1.15K; Supplier 1: Digi-Key; ComponentLink1URL: http://www.vishay.com/docs/28773/crcwce3.pdf; Supplier Part Number 1: 541-1.15KLCT-ND
R18 = 7216: as R117 on sheet Feedback; Status: Released; Package: 0402; Value: 10K; Supplier 1: Digi-Key; ComponentLink1URL: https://www.digikey.com/en/products/detail/panasonic-electronic-components/ERJ-2RKF1002X/192073; Supplier Part Number 1: P10.0KLCT-ND
R21 = 175: SENSOR, THERMISTOR, NTC, 10K, 1%, 3380K, 100mW, 0402; Mfg: Murata Electronics; Value: 10KOHM; Status: Released; Package: 0402; Supplier 1: Digi-Key; ComponentLink1URL: https://www.murata.com/en-us/api/pdfdownloadapi?cate=&partno=NCP15XH103F03RC; Supplier Part Number 1: 490-4801-1-ND
R157 = 9999: as R160 on sheet Feedback; Status: Released; Package: 2512; Value: 0.0015 OHM; Supplier 1: Digi-Key; ComponentLink1URL: https://www.te.com/commerce/DocumentDelivery/DDEController?Action=srchrtrv&DocNm=1773449-3&DocType=DS&DocLang=English; Supplier Part Number 1: A131795CT-ND
TP8 = TEST_KEYSTONE5015: as TP4 on sheet Feedback; Supplier 1: Digi-Key; ComponentLink1URL: http://mail.keyelco.com/ENG._DEPT/PDF%20CAT%20NO%20Drawings/5015.pdf; Supplier Part Number 1: 36-5015CT-ND; Status: In Development
U11 = 820: IC, MOTOR DRIVER, DRV8353, MULTIPHASE, BLDC, HALF BRIDGE, POWER MOSFET, 6V TO 95V VIN, VQFN-48; MFG: Texas Instruments; Status: Released; Package: 48-VQFN (7x7); Supplier 1: Digi-Key; ComponentLink1URL: https://www.ti.com/lit/ds/symlink/drv8350.pdf?HQS=TI-null-null-digikeymode-df-pf-null-wwe&ts=1593096373926; Supplier Part Number 1: 296-50273-1-ND; Value: DRV8353RSRGZT
U20 = INA240A1: as U12 on sheet Feedback; Supplier 1: Digi-Key; Supplier Part Number 1: 296-51172-1-ND; ComponentLink1URL: https://www.digikey.com/en/products/detail/texas-instruments/INA240A1DR/8538109; MFG P/N: INA240A1DR; Value: INA240A1DR

## Sheet HBridge.SchDoc
size 420 x 297 mm; DocumentNumber: 3; SheetNumber: 12; SheetTotal: 14; PageSetup: Record=PageOptions|CenterHorizontal=True|CenterVertical=True|PrintScale=0.96|XCorrection=1.00|YCorrection=1.00|PrintKind=1|BorderSize=5000000|LeftOffset=0|BottomOffset=0|Orientation=2|PaperLength=4318|PaperWidth=2794|Scale=100|PaperSource=7|PrintQuality=600|MediaType=1|DitherType=10|PaperKind=11" x 17"|PrintScaleMode=1
Used 3 times, as channels mezz/Holberton_Child/driver/PHA, mezz/Holberton_Child/driver/PHB, mezz/Holberton_Child/driver/PHC. Parts and nets are listed once, with the designators drawn on the sheet.
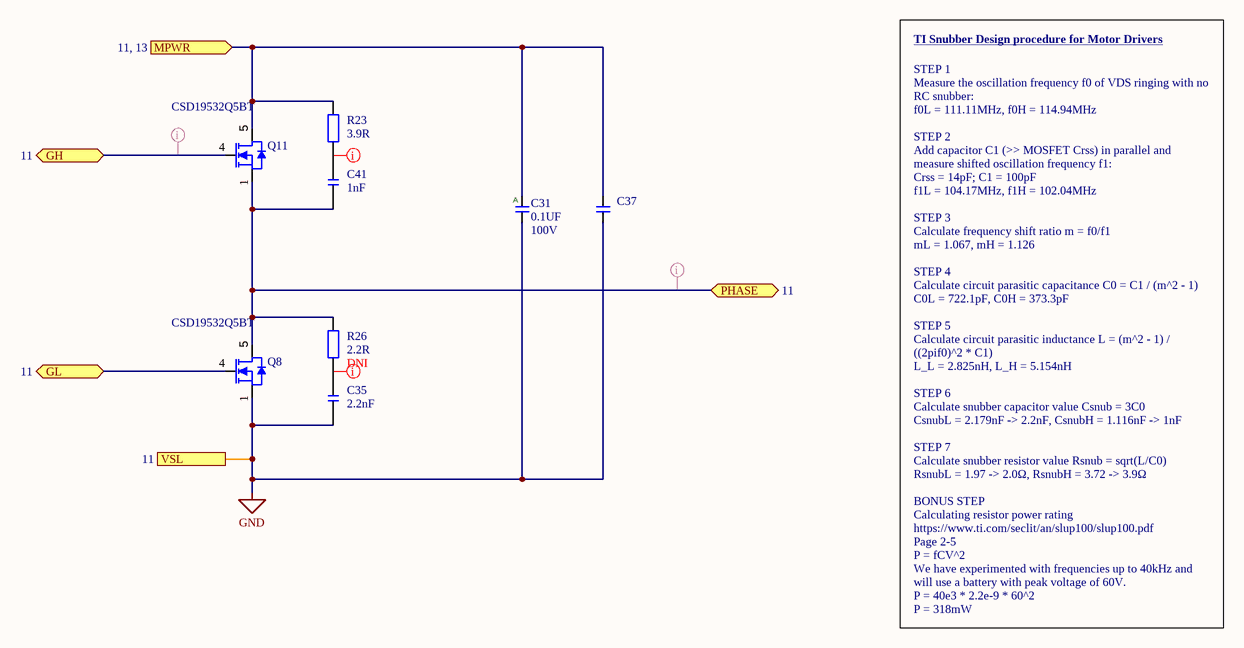
[diagram p11: HBridge.SchDoc]

### Parts
C31  value 0.1UF  Voltage: 100V  [C0603]  (hidden comment: __Template_Cap_Auto)
C35  2.2nF  [C0603]
C37  4.7UF  [C1210]  (value not drawn)
C41  1nF  [C0603]
NT3  Mechanical Feature NET_TIE_10MIL  [NETTIE_10MIL]  (value not drawn)  (net tie, no BOM)
Q8  value CSD19532Q5BT  [TI_SON5X6]  (hidden comment: TI CSD19532Q5B)
Q11  value CSD19532Q5BT  [TI_SON5X6]  (hidden comment: TI CSD19532Q5B)
R23  3.9R  [R0805]
R26  2.2R  [R0805]

### Ports
GH (bidir, see 11), GL (bidir, see 11), MPWR (in, see 11, 13), PHASE (bidir, see 11), VSL (out, see 11)

### Nets
GND: C31.2 C35.1 C37.2 NT3.2 Q8.1(S)
GH: Q11.4(G) ; port GH
GL: Q8.4(G) ; port GL
MPWR: C31.1 C37.1 Q11.5(D) R23.2 ; port MPWR
PHASE: C41.1 Q8.5(D) Q11.1(S) R26.2 ; port PHASE
VSL: NT3.1 ; port VSL
NetC35_2: C35.2 R26.1
NetC41_2: C41.2 R23.1

### Channels
mezz/Holberton_Child/driver/PHA: designators end in _PHA; ports GH=GHA GL=GLA MPWR=MPWR PHASE=PHASEA VSL=SNA
mezz/Holberton_Child/driver/PHB: designators end in _PHB; ports GH=GHB GL=GLB MPWR=MPWR PHASE=PHASEB VSL=SNB
mezz/Holberton_Child/driver/PHC: designators end in _PHC; ports GH=GHC GL=GLC MPWR=MPWR PHASE=PHASEC VSL=SNC

### Layout directives
net class HVSW: GHA, PHASEA
net class HV: NetC35_PHA_2, NetC41_PHA_2

### Notes on the sheet
- TI Snubber Design procedure for Motor Drivers <https://e2e.ti.com/support/motor-drivers-group/motor-drivers/f/motor-drivers-forum/991693/faq-proper-rc-snubber-design-for-motor-drivers>
- STEP 1
  Measure the oscillation frequency f0 of VDS ringing with no RC snubber:
  f0L = 111.11MHz, f0H = 114.94MHz
  STEP 2
  Add capacitor C1 (>> MOSFET Crss) in parallel and measure shifted oscillation frequency f1:
  Crss = 14pF; C1 = 100pF
  f1L = 104.17MHz, f1H = 102.04MHz
  STEP 3
  Calculate frequency shift ratio m = f0/f1
  mL = 1.067, mH = 1.126
  STEP 4
  Calculate circuit parasitic capacitance C0 = C1 / (m^2 - 1)
  C0L = 722.1pF, C0H = 373.3pF
  STEP 5
  Calculate circuit parasitic inductance L = (m^2 - 1) / ((2pif0)^2 * C1)
  L_L = 2.825nH, L_H = 5.154nH
  STEP 6
  Calculate snubber capacitor value Csnub = 3C0
  CsnubL = 2.179nF -> 2.2nF, CsnubH = 1.116nF -> 1nF
  STEP 7
  Calculate snubber resistor value Rsnub = sqrt(L/C0)
  RsnubL = 1.97 -> 2.0Ω, RsnubH = 3.72 -> 3.9Ω
  BONUS STEP
  Calculating resistor power rating
  https://www.ti.com/seclit/an/slup100/slup100.pdf
  Page 2-5
  P = fCV^2
  We have experimented with frequencies up to 40kHz and will use a battery with peak voltage of 60V.
  P = 40e3 * 2.2e-9 * 60^2
  P = 318mW
- CREATIVE COMMONS
- PUBLIC LICENSE:
- BARKOUR ROBOT
- CC BY-NC 4.0
- APPROVED
- DWG NO
- GOOGLE LLC
- FILE
- RELEASED
- 2024/05/09
- SIZE
- 1600 AMPHITHEATRE PARKWAY
- MOUNTAIN VIEW CA 94043
- A3
- SHEET
- OF
- THIS DESIGN IS BEING PROVIDED  FOR NON-COMMERCIAL USE ONLY. THE USE OF =SCIENTIST_NAME_POSSESSIVE NAME IN CONNECTION WITH THE DESIGN IS NOT INTENDED TO IMPLY THAT =SCIENTIST_NAME SPONSORS OR ENDORSES THE DESIGN, GOOGLE LLC, OR ANY OF GOOGLE LLC'S PRODUCTS OR SERVICES.
- (in symbol 1039) A

### Library data of the parts
C31 = 1039: as C26 on sheet Drive; Status: Released; Package: 0603; Supplier 1: Digi-Key; ComponentLink1URL: https://www.digikey.com/en/products/detail/tdk-corporation/CGA3E3X7S2A104K080AB/2672831; Supplier Part Number 1: 445-6938-1-ND
C35 = C: Multilayer Ceramic Capacitors MLCC - SMD/SMT 0603 2.2nF 100volts X7R 10%; MFG: Vishay / Vitramon; MFG P/N: VJ0603Y222KXBAC31X; Voltage: 100V; ComponentLink1URL: https://www.mouser.com/datasheet/2/427/vj31xrohsautomlcc-1763818.pdf; Supplier 1: Mouser; Supplier Part Number 1: 77-V0603Y222KXBAC31X; Value: 2.2nF
C37 = CAP_CER_1210_4.7UF_100V_20%_X7S: CAP CER 4.7UF 100V X7S 1210; MFG: Taiyo Yuden; MFG P/N: HMK325C7475MM-PE; Supplier 1: Digi-Key; Supplier Part Number 1: 587-5040-1-ND; ComponentLink1URL: https://www.digikey.com/en/products/detail/taiyo-yuden/HMK325C7475MM-PE/6563633; Value: 4.7UF; Voltage: 100V; Package: 1210
C41 = C: Multilayer Ceramic Capacitors MLCC - SMD/SMT 0603 1.0nF 100volts X7R 10%; MFG: Vishay / Vitramon; MFG P/N: VJ0603Y102KXBAC31X; Voltage: 100V; ComponentLink1URL: https://www.mouser.com/datasheet/2/427/vj31xrohsautomlcc-1763818.pdf; Supplier 1: Mouser; Supplier Part Number 1: 77-V0603Y102KXBAC31X; Value: 1nF
NT3 = 5ac3c692-7d27-4cd1-ace3-d4aa111a5a9d: Net Tie, 10mil trace; Package: Net Tie, 10mil trace; Status: Preliminary
Q8 Q11 = be020311-d2d7-4d79-a360-c856c6f37d83: MOSFET N-CH 100V 100A 8SON; MFG: Texas Instruments; Package: 8-PowerTDFN SON5x6; ComponentLink1URL: https://www.digikey.com/en/products/detail/texas-instruments/CSD19532Q5BT/6110536?s=N4IgjCBcpgbFoDGUBmBDANgZwKYBoQB7KAbRACYBOAFgA4AGeAXQIAcAXKEAZXYCcAlgDsA5iAC%2BBWJQQhkkdNnxFSIavUoBmLSBYgOXXoNESCAVgDs9WfMW4CxSGU0Wr1GXoOQe-YWMkgsIw2qJj2Kk4gLrSUsbpsnN5GfqaB9LQhCmHKjmSwtGYaIFIFYNaeiT7G-gRg5Jrw0HKhSg6qYBaaZRAVhr4mAeSMGU222W2RZfQABABq8fqVAKpCAuwA8igAsjhoWACufDipALTkmfz7OapmuuL3QA; Status: Preliminary; MFG P/N: CSD19532Q5BT; Supplier 1: Digi-Key; Supplier Part Number 1: 296-44471-1-ND
R23 = R: RES SMD 3.9 OHM 5% 1/2W 0805; MFG: Panasonic Electronic Components; MFG P/N: ERJ-HP6F3R90V; ComponentLink1URL: https://www.digikey.com/en/products/detail/panasonic-electronic-components/ERJ-HP6F3R90V/13877855; Supplier 1: Digi-Key; Supplier Part Number 1: 10-ERJ-HP6F3R90VCT-ND; Value: 3.9R; Package: 0805
R26 = R: RES SMD 2.2 OHM 1% 1/2W 0805; MFG: Vishay Dale; MFG P/N: CRCW08052R20FKEAHP; ComponentLink1URL: https://www.digikey.com/en/products/detail/vishay-dale/CRCW08052R20FKEAHP/2226670; Supplier 1: Digi-Key; Supplier Part Number 1: 541-2.20TCT-ND; Value: 2.2R; DNI: DNI

## Sheet STO.SchDoc
size 420 x 297 mm; DocumentNumber: 7; SheetNumber: 14; SheetTotal: 14; PageSetup: Record=PageOptions|CenterHorizontal=True|CenterVertical=True|PrintScale=0.96|XCorrection=1.00|YCorrection=1.00|PrintKind=1|BorderSize=5000000|LeftOffset=0|BottomOffset=0|Orientation=2|PaperLength=4318|PaperWidth=2794|Scale=100|PaperSource=7|PrintQuality=600|MediaType=1|DitherType=10|PaperKind=11" x 17"|PrintScaleMode=1
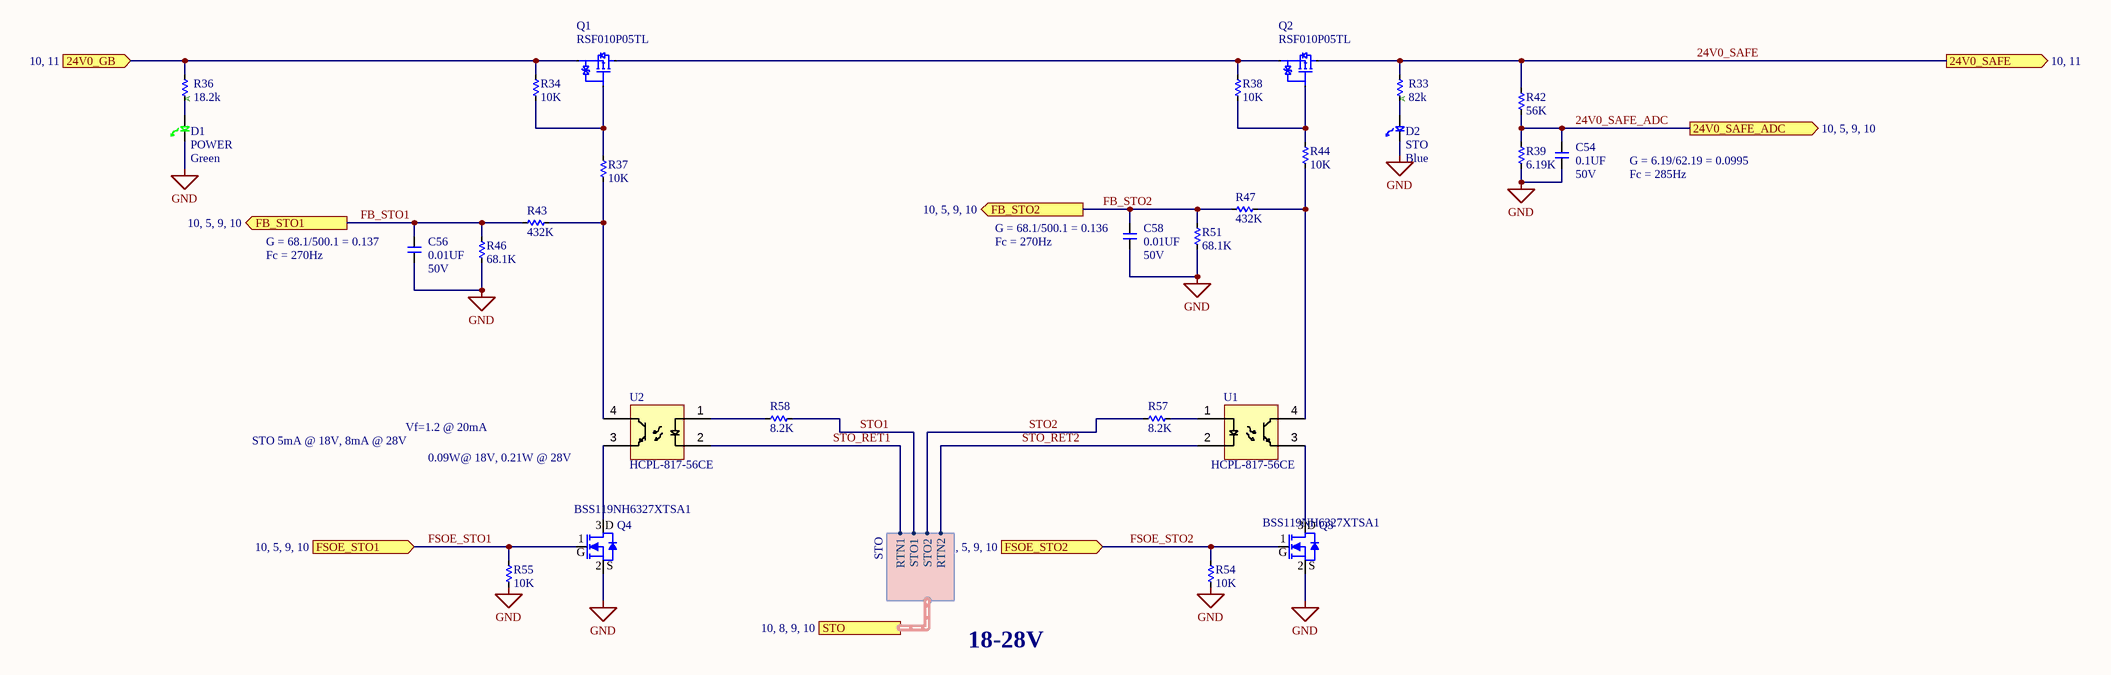
[diagram p12: STO.SchDoc]

### Parts
C54  value 0.1UF  Voltage: 50V  [C0402]  (hidden comment: __Template_Cap)
C56  value 0.01UF  Voltage: 50V  [C0402]  (hidden comment: __Template_Cap)
C58  value 0.01UF  Voltage: 50V  [C0402]  (hidden comment: __Template_Cap)
D1  POWER  value Green  [LEDSC160X80X90L40-GREEN]
D2  STO  value Blue  [LEDSC160X80X90L40-BLUE]
Q1  MFG P/N: RSF010P05TL  [TUMT3]  (hidden comment: PFET_RSF010P05TL)
Q2  MFG P/N: RSF010P05TL  [TUMT3]  (hidden comment: PFET_RSF010P05TL)
Q3  value BSS119NH6327XTSA1  [SOT23-3P95_240X110L43N]  (hidden comment: ONSEMI BSS123)
Q4  value BSS119NH6327XTSA1  [SOT23-3P95_240X110L43N]  (hidden comment: ONSEMI BSS123)
R33  value 82k  [R0402]  (hidden comment: PANASONIC ERJ2RKF8202X)
R34  10K  [R0402]
R36  value 18.2k  [R0402]  (hidden comment: PANASONIC ERJ2RKF1822X)
R37  10K  [R0402]
R38  10K  [R0402]
R39  6.19K  [R0402]
R42  56K  [R0402]
R43  432K  [R0402]
R44  10K  [R0402]
R46  68.1K  [R0402]
R47  432K  [R0402]
R51  68.1K  [R0402]
R54  10K  [R0402]
R55  10K  [R0402]
R57  8.2K  [R1206]
R58  8.2K  [R1206]
U1  MFG P/N: HCPL-817-56CE  [OPTO_HCPL-817-56CE]  (hidden comment: OPTO_HCPL-817-56CE)
U2  MFG P/N: HCPL-817-56CE  [OPTO_HCPL-817-56CE]  (hidden comment: OPTO_HCPL-817-56CE)

### Ports
24V0_GB (in, see 10, 11), 24V0_SAFE (out, see 10, 11), 24V0_SAFE_ADC (out, see 10, 5, 9, 10), FB_STO1 (out, see 10, 5, 9, 10), FB_STO2 (out, see 10, 5, 9, 10), FSOE_STO1 (in, see 10, 5, 9, 10), FSOE_STO2 (in, see 10, 5, 9, 10), STO (harness STO, see 10, 8, 9, 10)

### Harnesses
STO: RTN1, RTN2, STO1, STO2

### Nets
24V0_GB: Q1.S R34.2 R36.2 ; port 24V0_GB
GND: C54.2 C56.2 C58.2 D1.1(CATHODE) D2.1(CATHODE) Q3.2(S) Q4.2(S) R39.1 R46.1 R51.1 R54.1 R55.1
24V0_SAFE: Q2.D R33.2 R42.2 ; port 24V0_SAFE
24V0_SAFE_ADC: C54.1 R39.2 R42.1 ; port 24V0_SAFE_ADC
FB_STO1: C56.1 R43.1 R46.2 ; port FB_STO1
FB_STO2: C58.1 R47.1 R51.2 ; port FB_STO2
FSOE_STO1: Q4.1(G) R55.2 ; port FSOE_STO1
FSOE_STO2: Q3.1(G) R54.2 ; port FSOE_STO2
STO1: R58.2 ; port STO.STO1
STO2: R57.1 ; port STO.STO2
STO_RET1: U2.2(Cathode) ; port STO.RTN1
STO_RET2: U1.2(Cathode) ; port STO.RTN2
NetD1_2: D1.2(ANODE) R36.1
NetD2_2: D2.2(ANODE) R33.1
NetQ1_D: Q1.D Q2.S R38.2
NetQ1_G: Q1.G R34.1 R37.2
NetQ2_G: Q2.G R38.1 R44.2
NetQ3_3: Q3.3(D) U1.3(Emitter)
NetQ4_3: Q4.3(D) U2.3(Emitter)
NetR37_1: R37.1 R43.2 U2.4(Collector)
NetR44_1: R44.1 R47.2 U1.4(Collector)
NetR57_2: R57.2 U1.1(Anode)
NetR58_1: R58.1 U2.1(Anode)

### Notes on the sheet
- Fc = 285Hz
- G = 6.19/62.19 = 0.0995
- Fc = 270Hz
- (near C56) G = 68.1/500.1 = 0.137
- (near C58) G = 68.1/500.1 = 0.136
- STO 5mA @ 18V, 8mA @ 28V
- Vf=1.2 @ 20mA
- 0.09W@ 18V, 0.21W @ 28V
- 18-28V
- CREATIVE COMMONS
- PUBLIC LICENSE:
- BARKOUR ROBOT
- CC BY-NC 4.0
- APPROVED
- DWG NO
- GOOGLE LLC
- FILE
- RELEASED
- 2024/05/09
- SIZE
- 1600 AMPHITHEATRE PARKWAY
- MOUNTAIN VIEW CA 94043
- A3
- SHEET
- OF
- THIS DESIGN IS BEING PROVIDED  FOR NON-COMMERCIAL USE ONLY. THE USE OF =SCIENTIST_NAME_POSSESSIVE NAME IN CONNECTION WITH THE DESIGN IS NOT INTENDED TO IMPLY THAT =SCIENTIST_NAME SPONSORS OR ENDORSES THE DESIGN, GOOGLE LLC, OR ANY OF GOOGLE LLC'S PRODUCTS OR SERVICES.
- (in symbol 78eec7e5-34dd-5b0c-8bd5-fdbc658ba047) A
- (in symbol 07680e2d-088d-5a06-a7a1-fe9cd6488fb2) A

### Library data of the parts
C54 = 1762: as C140 on sheet Feedback; Status: Released; Package: 0402; Supplier 1: Digi-Key; ComponentLink1URL: http://www.yageo.com/documents/recent/UPY-GPHC_X5R_4V-to-50V_25.pdf; Supplier Part Number 1: 311-3342-1-ND
C56 C58 = 625: as C127 on sheet Feedback; Status: Released; Package: 0402; Supplier 1: Digi-Key; ComponentLink1URL: https://www.digikey.com/en/products/detail/kemet/C0402C103M5RAC7867/2196227; Supplier Part Number 1: 399-C0402C103M5RAC7867CT-ND
D1 = 97055cde-46be-5a44-ad2e-f3c9fb2da68b: LED, GREEN, 569nm, 30mA, CLEAR, 0603; MFG: Lite-On Inc.; MFG P/N: LTST-C190GKT; Package: 0603 (1608 Metric); ComponentLink1URL: http://media.digikey.com/pdf/Data%20Sheets/Lite-On%20PDFs/LTST-C190GKT.pdf; Status: Released; Supplier 1: Digi-Key; Supplier Part Number 1: 160-1183-1-ND
D2 = f11939b8-268a-575b-b7c2-77af98891583: LED, BLUE, 470nm, 15mA, DIFFUSED, 0603; MFG: OSRAM Opto (ams OSRAM); MFG P/N: LB Q39E-N1OO-35-1; Package: 0603 (1608 Metric); ComponentLink1URL: https://www.digikey.com/en/products/detail/osram-opto-ams-osram/LB-Q39E-N1OO-35-1/2176321; Status: Released; Supplier 1: Digi-Key; Supplier Part Number 1: 475-2815-1-ND
Q1 Q2 = 171: MOSFET, PWR, P-CH, 45VDS, 1A ID, 460mOhm@ 1A, SMD-3; MFG: Rohm Semiconductor; Status: Released; Package: TUMT3; ComponentLink1URL: https://d1d2qsbl8m0m72.cloudfront.net/en/products/databook/datasheet/discrete/transistor/mosfet/rsf010p05tl-e.pdf; Supplier 1: Digi-Key; Supplier Part Number 1: RSF010P05TLCT-ND; Value: RSF010P05TL
Q3 Q4 = ed20cc43-0059-5b34-85f4-540c7b2cf9db: XSTR, MOSFET, ENHANCEMENT MODE, N-CH, 100V, 0.17A, SOT23-3; Package: SOT-23; ComponentLink1URL: https://www.digikey.com/en/products/detail/infineon-technologies/BSS119NH6327XTSA1/5409997; Status: Released; MFG: onsemi; MFG P/N: BSS119NH6327XTSA1; Supplier 1: Digi-Key; Supplier Part Number 1: BSS119NH6327XTSA1CT-ND
R33 = 07680e2d-088d-5a06-a7a1-fe9cd6488fb2: Res, 82k, +/-1%, 0.1W, 0402, AUTO GRADE; MFG: Panasonic Electronic Components; MFG P/N: ERJ-2RKF8202X; Package: 0402; ComponentLink1URL: http://industrial.panasonic.com/cdbs/www-data/pdf/RDA0000/AOA0000C304.pdf; Status: Preliminary; Supplier 1: Digi-Key; Supplier Part Number 1: P82.0KLCT-ND
R34 R37 R38 R44 R54 R55 = 7216: as R117 on sheet Feedback; Status: Released; Package: 0402; Value: 10K; Supplier 1: Digi-Key; ComponentLink1URL: https://www.digikey.com/en/products/detail/panasonic-electronic-components/ERJ-2RKF1002X/192073; Supplier Part Number 1: P10.0KLCT-ND
R36 = 78eec7e5-34dd-5b0c-8bd5-fdbc658ba047: Res, 18.2k, +/-1%, 0.1W, 0402, AUTO GRADE; MFG: Panasonic Electronic Components; MFG P/N: ERJ-2RKF1822X; Package: 0402; ComponentLink1URL: http://industrial.panasonic.com/cdbs/www-data/pdf/RDA0000/AOA0000C304.pdf; Status: Preliminary; Supplier 1: Digi-Key; Supplier Part Number 1: P18.2KLCT-ND
R39 = 9146: RES, 6.19K, 1%, 1/16W, 0402; MFG: Yageo; MFG P/N: RC0402FR-076K19L; Status: Released; Package: 0402; Value: 6.19K; Supplier 1: Digi-Key; ComponentLink1URL: http://www.yageo.com/documents/recent/PYu-RC_Group_51_RoHS_L_10.pdf; Supplier Part Number 1: 311-6.19KLRCT-ND
R42 = 8099: RES, 56K, 1%, 1/16W, 0402; MFG: VISHAY; MFG P/N: CRCW040256K0FKED; COMMON: 470-02723-00; Status: Released; Package: 0402; Value: 56K; Supplier 1: Digi-Key; ComponentLink1URL: https://www.digikey.com/en/products/detail/vishay-dale/CRCW040256K0FKED/1178206; Supplier Part Number 1: 541-56.0KLCT-ND
R43 R47 = 8801: as R16 on sheet Drive; Status: Released; Package: 0402; Value: 432K; Supplier 1: Digi-Key; ComponentLink1URL: http://www.vishay.com/docs/28773/crcwce3.pdf; Supplier Part Number 1: 541-432KLCT-ND
R46 R51 = 4849: RES, 68.1K, 1%, 1/16W, 0402; MFG: Stackpole Electronics Inc; MFG P/N: RMCF0402FT68K1; Status: Released; Package: 0402; Value: 68.1K; Supplier 1: Digi-Key; ComponentLink1URL: https://www.digikey.com/en/products/detail/stackpole-electronics-inc/RMCF0402FT68K1/1761637; Supplier Part Number 1: RMCF0402FT68K1CT-ND
R57 R58 = 3733: RES 8.2K OHM 1% 1/4W 1206; MFG: STACKPOLE ELECTRONICS; MFG P/N: RMCF1206FT8K20; Status: Released; Package: 1206; Value: 8.2K; Supplier 1: Digi-Key; ComponentLink1URL: https://www.digikey.com/en/products/detail/stackpole-electronics-inc/RMCF1206FT3K30/1753917; Supplier Part Number 1: RMCF1206FT8K20CT-ND
U1 U2 = 276: ISOLATOR, OPTOISOLATOR, PHOTO TRANSISTOR, 70V, 50mA, SMD-4; MFG: Broadcom Limited; Status: Released; Package: 4-SMD; Supplier 1: Digi-Key; ComponentLink1URL: https://docs.broadcom.com/doc/AV02-0265EN; Supplier Part Number 1: 516-3136-1-ND; Value: HCPL-817-56CE

## Sheet EtherCATConnectors.SchDoc
size 420 x 297 mm; SheetNumber: 8; SheetTotal: 14; PageSetup: Record=PageOptions|CenterHorizontal=True|CenterVertical=True|PrintScale=0.96|XCorrection=1.00|YCorrection=1.00|PrintKind=1|BorderSize=5000000|LeftOffset=0|BottomOffset=0|Orientation=2|PaperLength=4318|PaperWidth=2794|Scale=100|PaperSource=7|PrintQuality=600|MediaType=1|DitherType=10|PaperKind=11" x 17"|PrintScaleMode=1
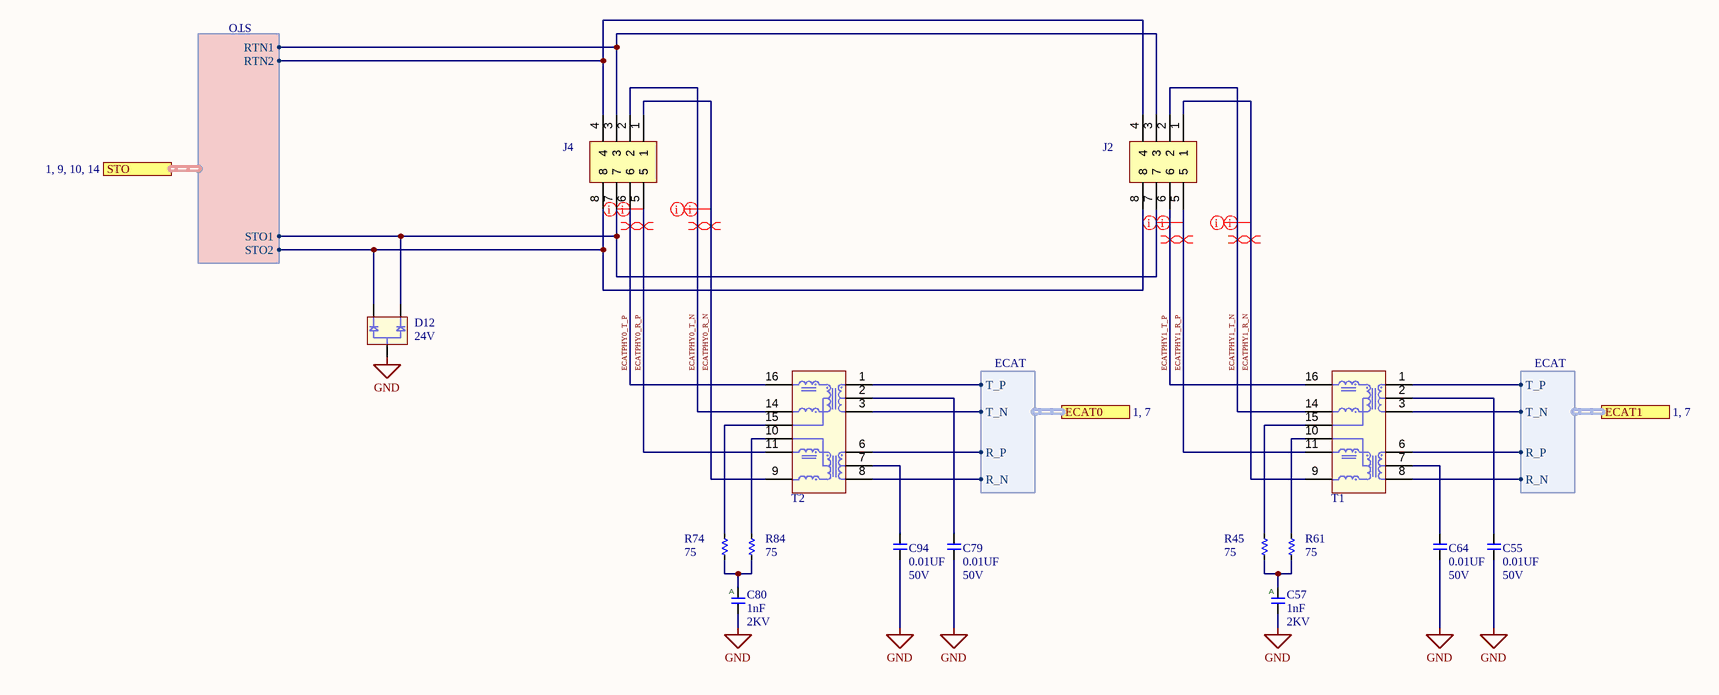
[diagram p13: EtherCATConnectors.SchDoc]

### Parts
C55  value 0.01UF  Voltage: 50V  [C0402]  (hidden comment: __Template_Cap)
C57  value 1nF  Voltage: 2KV  [C1210]  (hidden comment: __Template_Cap_Auto)
C64  value 0.01UF  Voltage: 50V  [C0402]  (hidden comment: __Template_Cap)
C79  value 0.01UF  Voltage: 50V  [C0402]  (hidden comment: __Template_Cap)
C80  value 1nF  Voltage: 2KV  [C1210]  (hidden comment: __Template_Cap_Auto)
C94  value 0.01UF  Voltage: 50V  [C0402]  (hidden comment: __Template_Cap)
D12  24V  [3SOT23]
J2  MOLEX_2X4_NANOFIT_1053141308  [MOLEX_1053141308]  (value not drawn)
J4  MOLEX_2X4_NANOFIT_1053141308  [MOLEX_1053141308]  (value not drawn)
R45  75  [R0402]
R61  75  [R0402]
R74  75  [R0402]
R84  75  [R0402]
T1  PULSE_H1102NL  [PULSE_HXXXX]  (value not drawn)
T2  PULSE_H1102NL  [PULSE_HXXXX]  (value not drawn)

### Ports
ECAT0 (harness ECAT, see 1, 7), ECAT1 (harness ECAT, see 1, 7), STO (harness STO, see 1, 9, 10, 14)

### Harnesses
ECAT: R_P, R_N, T_P, T_N
STO: STO1, RTN2, STO2, RTN1

### Nets
GND: C55.2 C57.2 C64.2 C79.2 C80.2 C94.2 D12.3
ECAT_R0_N: T2.8 ; port ECAT0.R_N
ECAT_R0_P: T2.6 ; port ECAT0.R_P
ECAT_R1_N: T1.8 ; port ECAT1.R_N
ECAT_R1_P: T1.6 ; port ECAT1.R_P
ECAT_T0_N: T2.3 ; port ECAT0.T_N
ECAT_T0_P: T2.1 ; port ECAT0.T_P
ECAT_T1_N: T1.3 ; port ECAT1.T_N
ECAT_T1_P: T1.1 ; port ECAT1.T_P
ECATPHY0_R_N: J4.1 T2.9
ECATPHY0_R_P: J4.5 T2.11
ECATPHY0_T_N: J4.2 T2.14
ECATPHY0_T_P: J4.6 T2.16
ECATPHY1_R_N: J2.1 T1.9
ECATPHY1_R_P: J2.5 T1.11
ECATPHY1_T_N: J2.2 T1.14
ECATPHY1_T_P: J2.6 T1.16
STO1: D12.1 J2.7 J4.7 ; port STO.STO1
STO2: D12.2 J2.8 J4.8 ; port STO.STO2
STO_RET1: J2.3 J4.3 ; port STO.RTN1
STO_RET2: J2.4 J4.4 ; port STO.RTN2
NetC55_1: C55.1 T1.2
NetC57_1: C57.1 R45.1 R61.1
NetC64_1: C64.1 T1.7
NetC79_1: C79.1 T2.2
NetC80_1: C80.1 R74.1 R84.1
NetC94_1: C94.1 T2.7
NetR45_2: R45.2 T1.15
NetR61_2: R61.2 T1.10
NetR74_2: R74.2 T2.15
NetR84_2: R84.2 T2.10

### Layout directives
differential pair; differential pair class 100Ohm: ECATPHY0_R_N, ECATPHY0_R_P, ECATPHY0_T_N, ECATPHY0_T_P, ECATPHY1_R_N, ECATPHY1_R_P, ECATPHY1_T_N, ECATPHY1_T_P
net class Diff100Ohm: ECATPHY0_R_N, ECATPHY0_R_P, ECATPHY0_T_N, ECATPHY0_T_P, ECATPHY1_R_N, ECATPHY1_R_P, ECATPHY1_T_N, ECATPHY1_T_P

### Notes on the sheet
- CREATIVE COMMONS
- PUBLIC LICENSE:
- BARKOUR ROBOT
- CC BY-NC 4.0
- APPROVED
- DWG NO
- GOOGLE LLC
- FILE
- RELEASED
- 2024/05/09
- SIZE
- 1600 AMPHITHEATRE PARKWAY
- MOUNTAIN VIEW CA 94043
- A3
- SHEET
- OF
- THIS DESIGN IS BEING PROVIDED  FOR NON-COMMERCIAL USE ONLY. THE USE OF =SCIENTIST_NAME_POSSESSIVE NAME IN CONNECTION WITH THE DESIGN IS NOT INTENDED TO IMPLY THAT =SCIENTIST_NAME SPONSORS OR ENDORSES THE DESIGN, GOOGLE LLC, OR ANY OF GOOGLE LLC'S PRODUCTS OR SERVICES.
- (in symbol 6) A

### Library data of the parts
C55 C64 C79 C94 = 625: as C127 on sheet Feedback; Status: Released; Package: 0402; Supplier 1: Digi-Key; ComponentLink1URL: https://www.digikey.com/en/products/detail/kemet/C0402C103M5RAC7867/2196227; Supplier Part Number 1: 399-C0402C103M5RAC7867CT-ND
C57 C80 = 6: CAP, CER, X7S, 1000PF, 2KV, 10%, 1210; MFG: TDK; MFG P/N: CGA6M1X7S3D102K200AA; COMMON: 150-01098-00; Status: Released; Package: 1210; Supplier 1: Digi-Key; ComponentLink1URL: https://www.digikey.com/en/products/detail/tdk-corporation/CGA6M1X7S3D102K200AA/3950274; Supplier Part Number 1: 445-13038-1-ND
D12 = 176: DIODE, TVS, UNIDIR, DUAL, 24VRWM, 26VBR, 41VCL, SOT-23-3; MFG: Infineon Technologies; MFG P/N: ESD24VS2UE6327HTSA1; Value: ESD24VS2UE6327HTSA1; Status: Released; Package: TO-236-3, SC-59, SOT-23-3; Supplier 1: Digi-Key; ComponentLink1URL: https://www.infineon.com/dgdl/Infineon-ESD24VS2U-DS-v01_01-en.pdf?fileId=db3a3043340fff53013413a2249d2ff3; Supplier Part Number 1: ESD24VS2UE6327HTSA1CT-ND
J2 J4 = MOLEX_2X4_NANOFIT_1053141308: CONN HEADER R/A 8POS 2.5MM; MFG: Molex; Supplier 1: Digi-Key; Supplier Part Number 1: WM15168-ND; ComponentLink1URL: https://www.digikey.com/en/products/detail/molex/1053141308/6164257; MFG P/N: 1053141308; Value: 1053141308
R45 R61 R74 R84 = 2283: RES, 75, 1%, 1/16W, 0402; MFG: YAGEO; MFG P/N: RC0402FR-0775RL; COMMON: 470-00607-00; Status: Released; Package: 0402; Value: 75; Supplier 1: Digi-Key; ComponentLink1URL: https://www.digikey.com/en/products/detail/yageo/RC0402FR-0775RL/726658; Supplier Part Number 1: 311-75.0LRCT-ND
T1 T2 = PULSE_H1102NL: Telecom Transformer 2(1:1) 0.65Ohm Prim. DCR 0.65Ohm Sec. DCR 16 Terminal Gull Wing SMD; MFG: Pulse Electronics; Supplier 1: Digi-Key; Supplier Part Number 1: 553-1323-5-ND; ComponentLink1URL: https://datasheet.ciiva.com/2938/10-100base-tsingleportsmdmagnetics-rev2008-2938779.pdf?src-supplier=Digi-Key; MFG P/N: H1102NL; Value: H1102NL